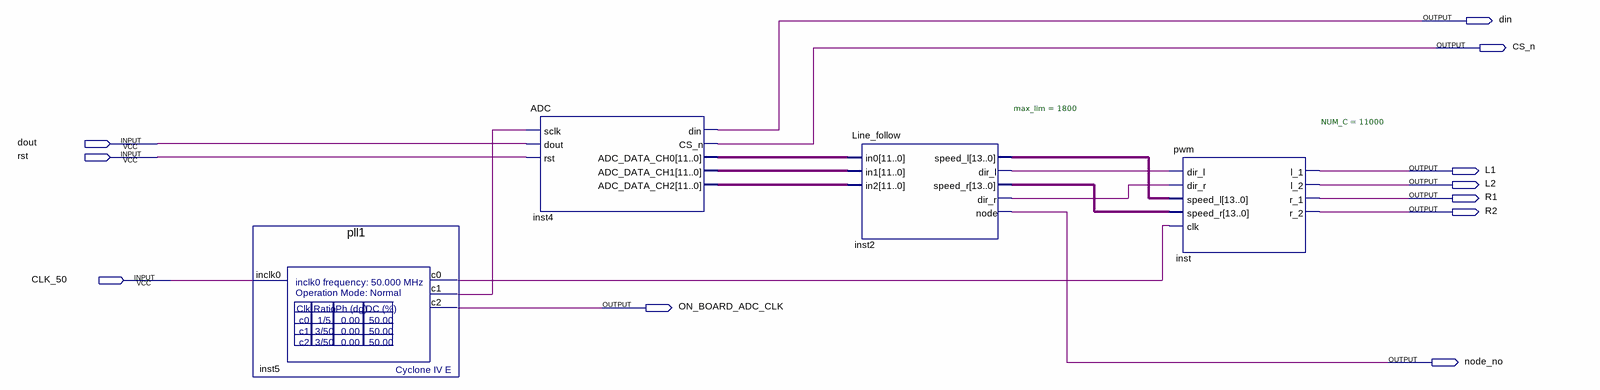
[diagram p0: schematic sheet]
// Quartus schematic custom_pwm1.bdf as structural Verilog: 4 symbols, 11 pins
module custom_pwm1 (
  input  dout,
  input  rst,
  input  CLK_50,
  output din,
  output CS_n,
  output L1,
  output L2,
  output R1,
  output R2,
  output ON_BOARD_ADC_CLK,
  output node_no
);

  wire inst2_dir_l, inst2_dir_r, inst5_c0, inst5_c1;
  wire [11:0] inst4_adc_data_ch0, inst4_adc_data_ch1, inst4_adc_data_ch2;
  wire [13:0] inst2_speed_l, inst2_speed_r;

  pll1 inst5 (.inclk0(CLK_50), .c0(inst5_c0), .c1(inst5_c1), .c2(ON_BOARD_ADC_CLK));
  ADC inst4 (
    .sclk(inst5_c1), .dout(dout), .rst(rst), .din(din), .CS_n(CS_n), .ADC_DATA_CH0(inst4_adc_data_ch0),
    .ADC_DATA_CH1(inst4_adc_data_ch1), .ADC_DATA_CH2(inst4_adc_data_ch2));
  Line_follow #(.max_lim(1800)) inst2 (
    .in0(inst4_adc_data_ch0), .in1(inst4_adc_data_ch1), .in2(inst4_adc_data_ch2), .speed_l(inst2_speed_l),
    .dir_l(inst2_dir_l), .speed_r(inst2_speed_r), .dir_r(inst2_dir_r), .node(node_no));
  pwm #(.NUM_C(11000)) inst (
    .dir_l(inst2_dir_l), .dir_r(inst2_dir_r), .speed_l(inst2_speed_l), .speed_r(inst2_speed_r),
    .clk(inst5_c0), .l_1(L1), .l_2(L2), .r_1(R1), .r_2(R2));
endmodule
